# EAGLE schematic carrier_breakout_box (EAGLE 9.5.2)
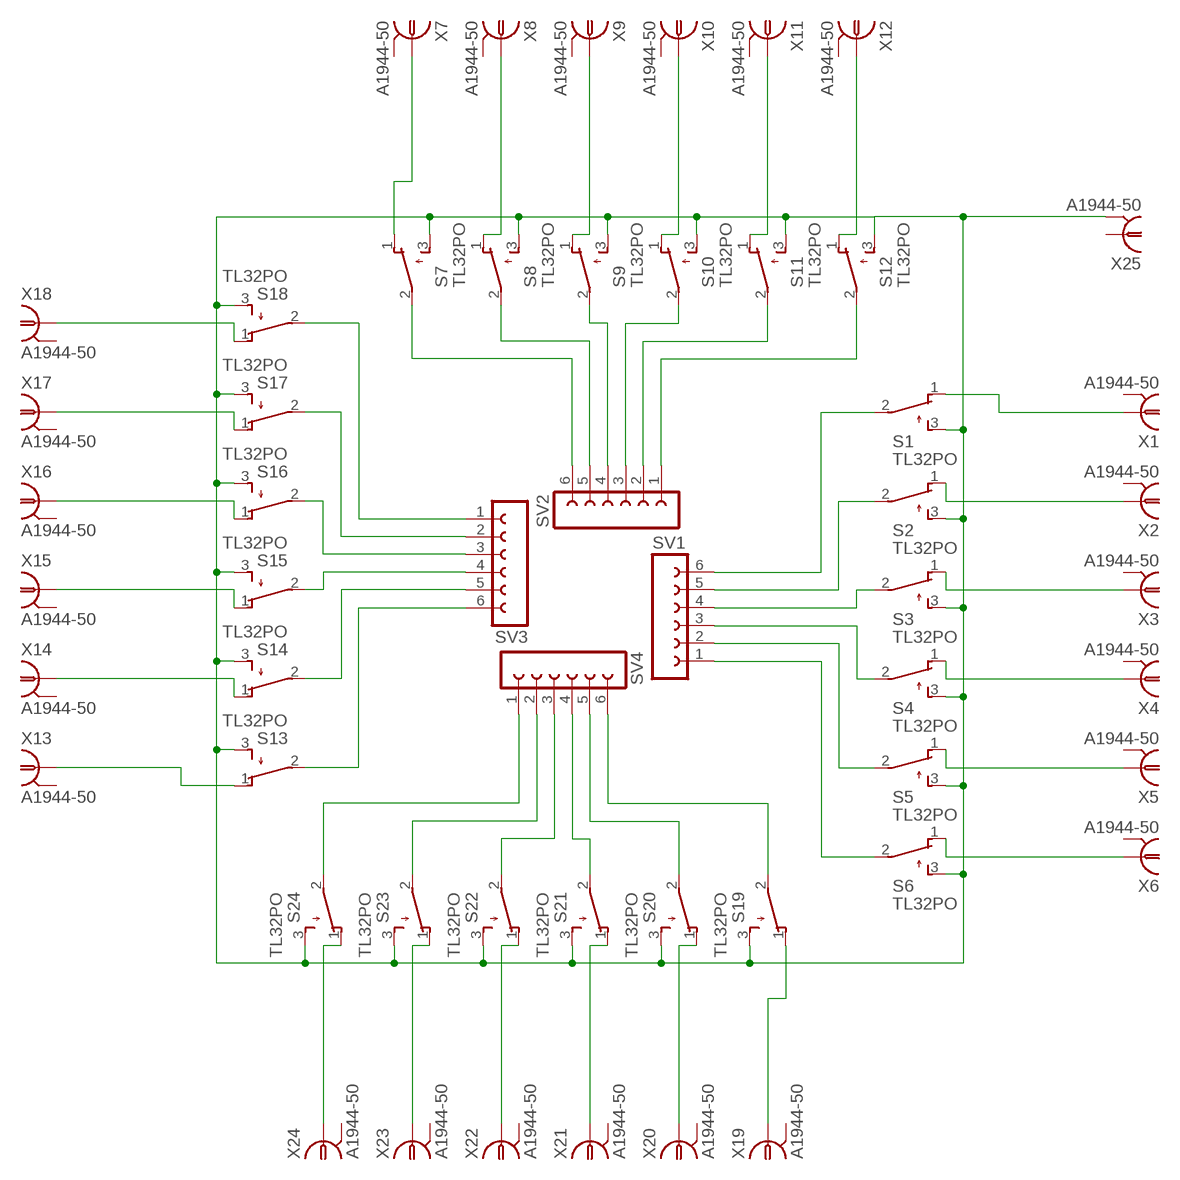
[diagram p0: schematic, sheet 1]

## Parts
S1  TL32PO  [TL3XPO]
S2  TL32PO  [TL3XPO]
S3  TL32PO  [TL3XPO]
S4  TL32PO  [TL3XPO]
S5  TL32PO  [TL3XPO]
S6  TL32PO  [TL3XPO]
S7  TL32PO  [TL3XPO]
S8  TL32PO  [TL3XPO]
S9  TL32PO  [TL3XPO]
S10  TL32PO  [TL3XPO]
S11  TL32PO  [TL3XPO]
S12  TL32PO  [TL3XPO]
S13  TL32PO  [TL3XPO]
S14  TL32PO  [TL3XPO]
S15  TL32PO  [TL3XPO]
S16  TL32PO  [TL3XPO]
S17  TL32PO  [TL3XPO]
S18  TL32PO  [TL3XPO]
S19  TL32PO  [TL3XPO]
S20  TL32PO  [TL3XPO]
S21  TL32PO  [TL3XPO]
S22  TL32PO  [TL3XPO]
S23  TL32PO  [TL3XPO]
S24  TL32PO  [TL3XPO]
SV1  FE06-1  [FE06]
SV2  FE06-1  [FE06]
SV3  FE06-1  [FE06]
SV4  FE06-1  [FE06]
X1  A1944-50  [A1944]
X2  A1944-50  [A1944]
X3  A1944-50  [A1944]
X4  A1944-50  [A1944]
X5  A1944-50  [A1944]
X6  A1944-50  [A1944]
X7  A1944-50  [A1944]
X8  A1944-50  [A1944]
X9  A1944-50  [A1944]
X10  A1944-50  [A1944]
X11  A1944-50  [A1944]
X12  A1944-50  [A1944]
X13  A1944-50  [A1944]
X14  A1944-50  [A1944]
X15  A1944-50  [A1944]
X16  A1944-50  [A1944]
X17  A1944-50  [A1944]
X18  A1944-50  [A1944]
X19  A1944-50  [A1944]
X20  A1944-50  [A1944]
X21  A1944-50  [A1944]
X22  A1944-50  [A1944]
X23  A1944-50  [A1944]
X24  A1944-50  [A1944]
X25  A1944-50  [A1944]

## Nets
N$1: S6.2(P) SV1.1
N$2: S5.2(P) SV1.2
N$3: S4.2(P) SV1.3
N$4: S3.2(P) SV1.4
N$5: S2.2(P) SV1.5
N$6: S1.2(P) SV1.6
N$7: S1.1(O) X1.1
N$8: S2.1(O) X2.1
N$9: S3.1(O) X3.1
N$10: S4.1(O) X4.1
N$11: S5.1(O) X5.1
N$12: S6.1(O) X6.1
N$14: S12.2(P) SV2.1
N$15: S11.2(P) SV2.2
N$16: S10.2(P) SV2.3
N$17: S9.2(P) SV2.4
N$18: S8.2(P) SV2.5
N$19: S7.2(P) SV2.6
N$20: S7.1(O) X7.1
N$21: S8.1(O) X8.1
N$22: S9.1(O) X9.1
N$23: S10.1(O) X10.1
N$24: S11.1(O) X11.1
N$25: S12.1(O) X12.1
N$26: S1.3(S) S2.3(S) S3.3(S) S4.3(S) S5.3(S) S6.3(S) S7.3(S) S8.3(S) S9.3(S) S10.3(S) S11.3(S) S12.3(S) S13.3(S) S14.3(S) S15.3(S) S16.3(S) S17.3(S) S18.3(S) S19.3(S) S20.3(S) S21.3(S) S22.3(S) S23.3(S) S24.3(S) X25.2 X25.3 X25.4 X25.5
N$27: S18.2(P) SV3.1
N$28: S17.2(P) SV3.2
N$29: S16.2(P) SV3.3
N$30: S15.2(P) SV3.4
N$31: S14.2(P) SV3.5
N$32: S13.2(P) SV3.6
N$33: S13.1(O) X13.1
N$34: S14.1(O) X14.1
N$35: S15.1(O) X15.1
N$36: S16.1(O) X16.1
N$37: S17.1(O) X17.1
N$38: S18.1(O) X18.1
N$40: S24.2(P) SV4.1
N$41: S23.2(P) SV4.2
N$42: S22.2(P) SV4.3
N$43: S21.2(P) SV4.4
N$44: S20.2(P) SV4.5
N$45: S19.2(P) SV4.6
N$46: S19.1(O) X19.1
N$47: S20.1(O) X20.1
N$48: S21.1(O) X21.1
N$49: S22.1(O) X22.1
N$50: S23.1(O) X23.1
N$51: S24.1(O) X24.1
Unconnected: X1.2 X1.3 X1.4 X1.5 X2.2 X2.3 X2.4 X2.5 X3.2 X3.3 X3.4 X3.5 X4.2 X4.3 X4.4 X4.5 X5.2 X5.3 X5.4 X5.5 X6.2 X6.3 X6.4 X6.5 X7.2 X7.3 X7.4 X7.5 X8.2 X8.3 X8.4 X8.5 X9.2 X9.3 X9.4 X9.5 X10.2 X10.3 X10.4 X10.5 X11.2 X11.3 X11.4 X11.5 X12.2 X12.3 X12.4 X12.5 X13.2 X13.3 X13.4 X13.5 X14.2 X14.3 X14.4 X14.5 X15.2 X15.3 X15.4 X15.5 X16.2 X16.3 X16.4 X16.5 X17.2 X17.3 X17.4 X17.5 X18.2 X18.3 X18.4 X18.5 X19.2 X19.3 X19.4 X19.5 X20.2 X20.3 X20.4 X20.5 X21.2 X21.3 X21.4 X21.5 X22.2 X22.3 X22.4 X22.5 X23.2 X23.3 X23.4 X23.5 X24.2 X24.3 X24.4 X24.5 X25.1

## Library data of the parts
S1-S24 = switch:TL32PO: TINY SWITCH ON - MOM Source: http://www2.produktinfo.conrad.com/datenblaetter/700000-724999/705152-da-01-de-Subminiaturschalter_TL_36YO.pdf
SV1-SV4 = con-lsta:FE06-1: FEMALE HEADER; OC_FARNELL: unknown; OC_NEWARK: unknown
X1-X25 = con-coax:A1944-50: BNC CONNECTOR 50 Ohm distributor Buerklin 78F2475; OC_FARNELL: unknown; OC_NEWARK: unknown